# Altium schematic sheet 6 Power.SchDoc
size 420 x 297 mm; SheetNumber: 7; SheetTotal: 9
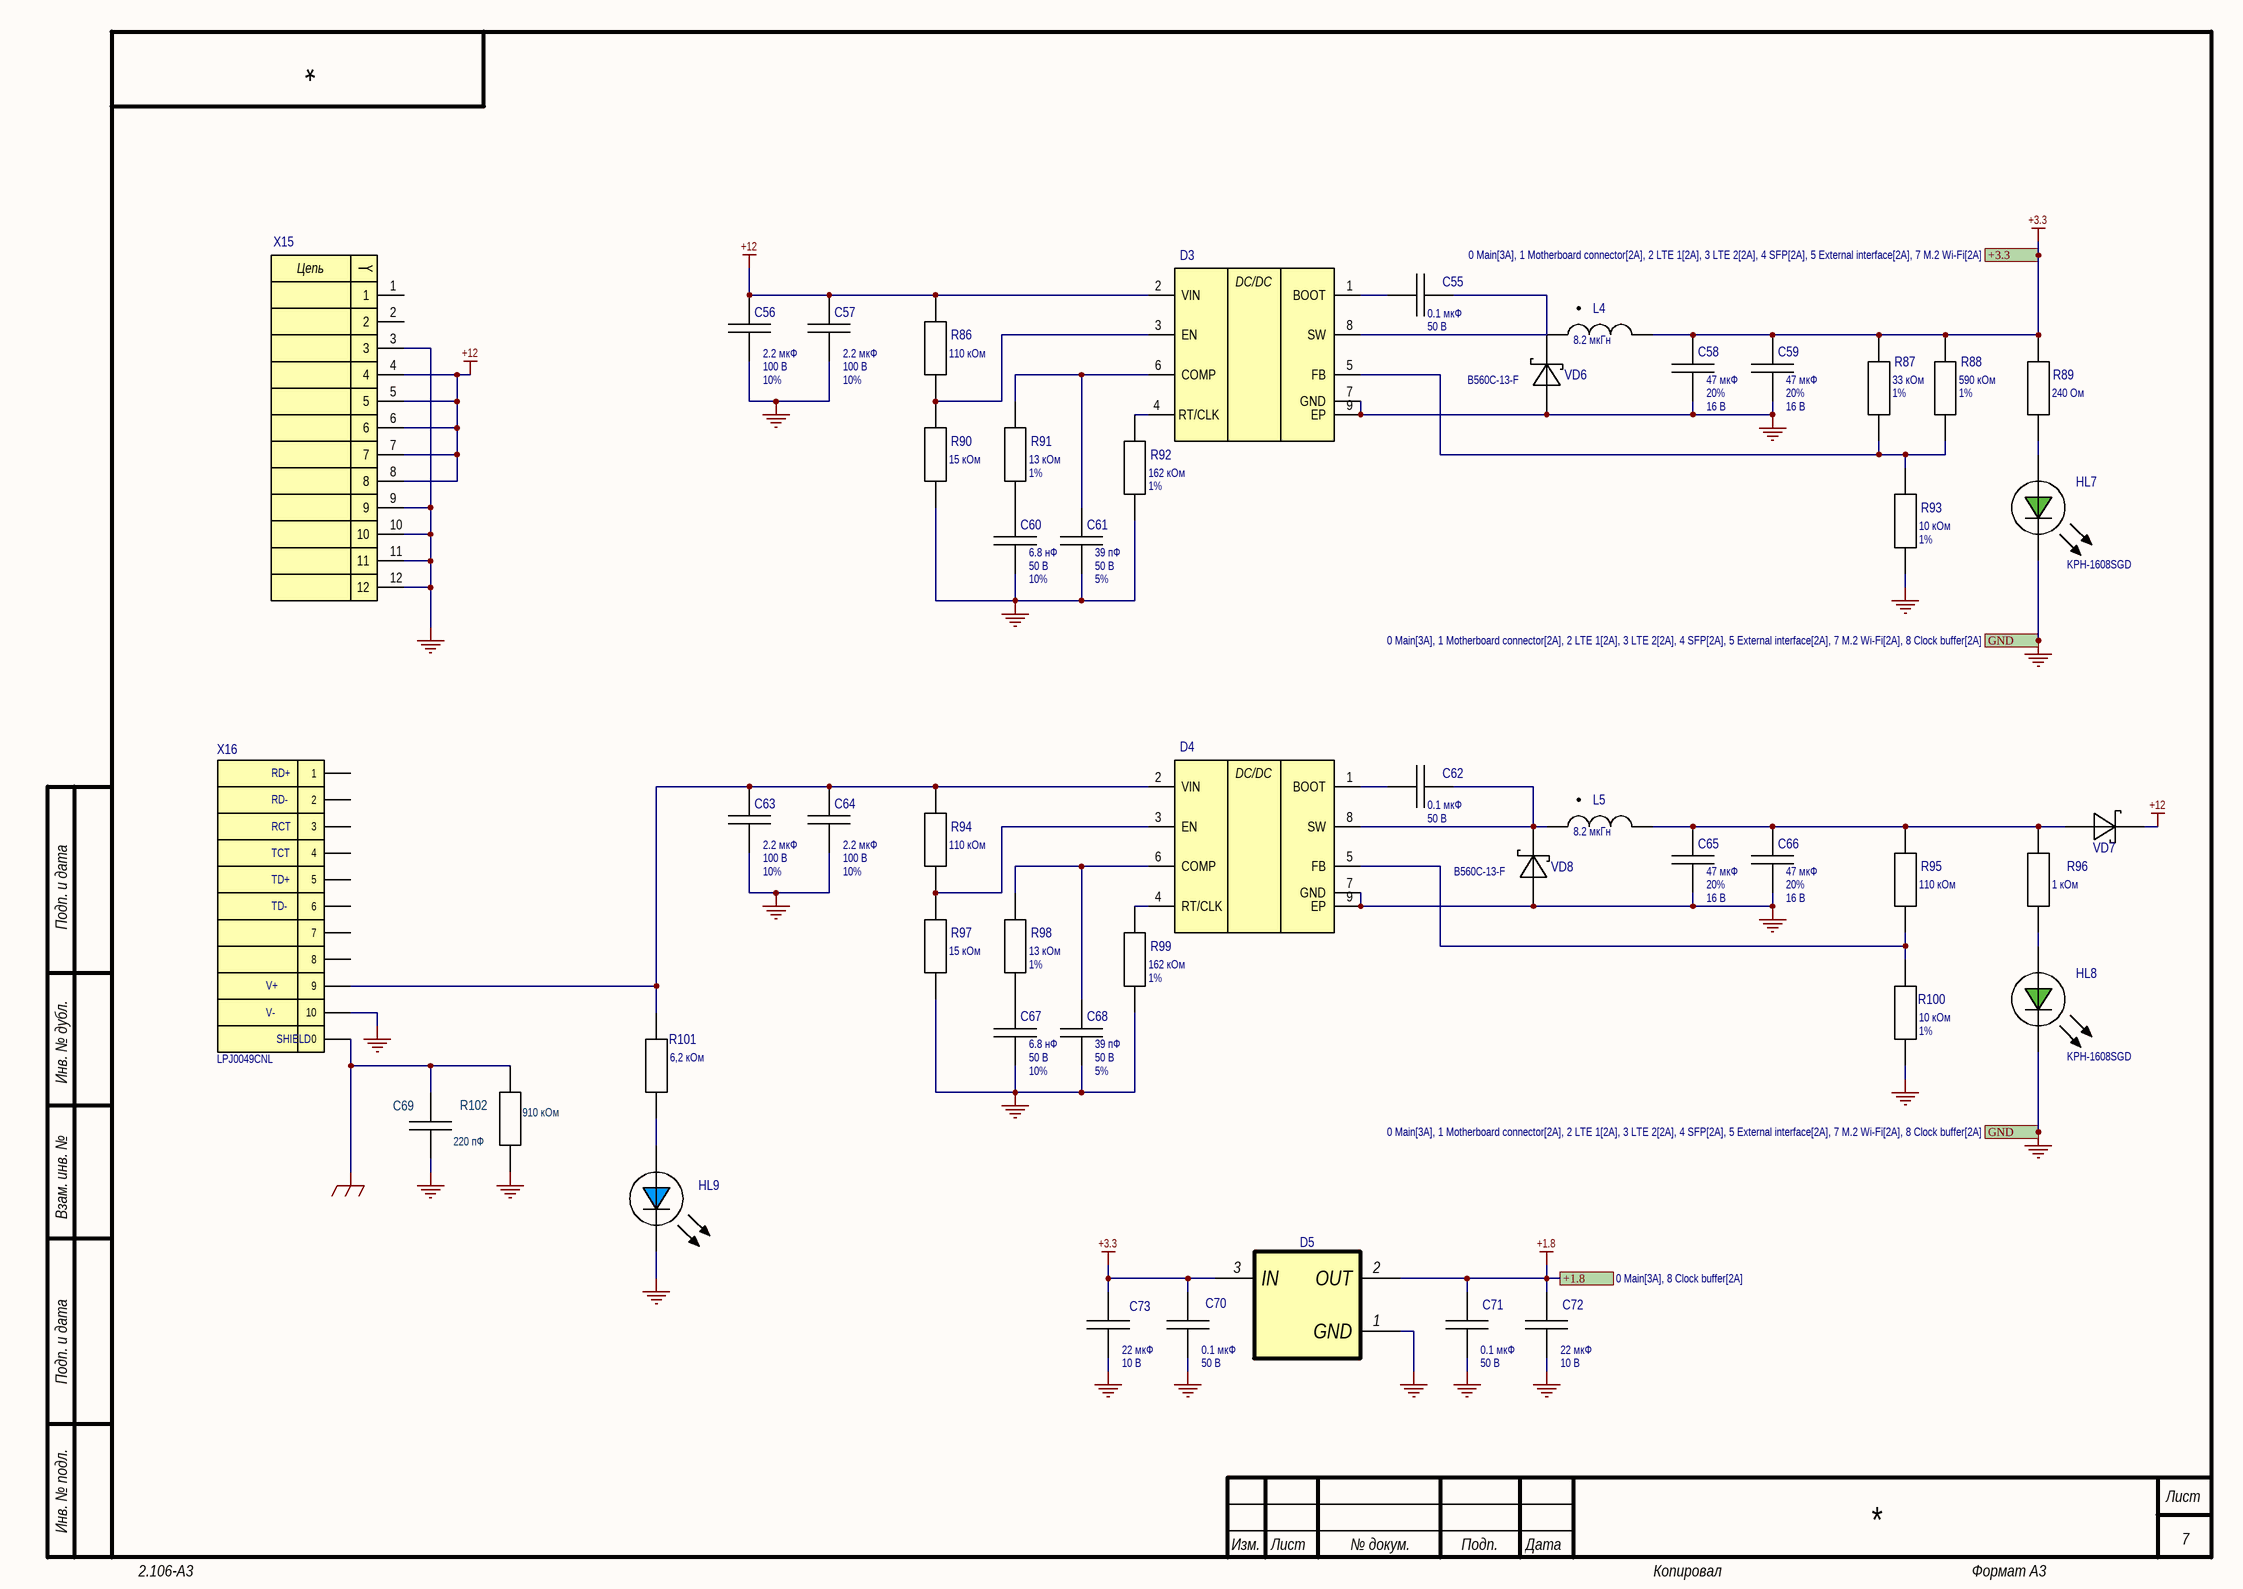
[diagram p0: 6 Power.SchDoc]

## Parts
C55  value 0.1 мкФ  Напряжение: 50 В  [CAP_0402]
C56  value 2.2 мкФ  Tolerance: 10%  Напряжение: 100 В  [CAP_1206]
C57  value 2.2 мкФ  Tolerance: 10%  Напряжение: 100 В  [CAP_1206]
C58  value 47 мкФ  Tolerance: 20%  Напряжение: 16 В  [CAP_1210]
C59  value 47 мкФ  Tolerance: 20%  Напряжение: 16 В  [CAP_1210]
C60  value 6.8 нФ  Tolerance: 10%  Напряжение: 50 В  [CAP_0402]
C61  value 39 пФ  Tolerance: 5%  Напряжение: 50 В  [CAP_0402]
C62  value 0.1 мкФ  Напряжение: 50 В  [CAP_0402]
C63  value 2.2 мкФ  Tolerance: 10%  Напряжение: 100 В  [CAP_1206]
C64  value 2.2 мкФ  Tolerance: 10%  Напряжение: 100 В  [CAP_1206]
C65  value 47 мкФ  Tolerance: 20%  Напряжение: 16 В  [CAP_1210]
C66  value 47 мкФ  Tolerance: 20%  Напряжение: 16 В  [CAP_1210]
C67  value 6.8 нФ  Tolerance: 10%  Напряжение: 50 В  [CAP_0402]
C68  value 39 пФ  Tolerance: 5%  Напряжение: 50 В  [CAP_0402]
C69  value 220 пФ  [CAP_1812]
C70  value 0.1 мкФ  Напряжение: 50 В  [CAP_0402]
C71  value 0.1 мкФ  Напряжение: 50 В  [CAP_0402]
C72  value 22 мкФ  Напряжение: 10 В  [CAP_0603]
C73  value 22 мкФ  Напряжение: 10 В  [CAP_0603]
D3  TPS54360DDA  [HSOIC-8_EP]  (value not drawn)
D4  TPS54360DDA  [HSOIC-8_EP]  (value not drawn)
D5  GM1117-1.8ST3R  [SOT-223]  (value not drawn)
HL7  KPH-1608SGD  [LED_0603_GREEN]
HL8  KPH-1608SGD  [LED_0603_GREEN]
HL9  XL-1608UBC-04  [LED_0603_BLUE]  (value not drawn)
L4  value 8.2 мкГн  [MWSA0603S]  (hidden comment: STD_IND)
L5  value 8.2 мкГн  [MWSA0603S]  (hidden comment: STD_IND)
R86  value 110 кОм  [RES_0603]  (hidden comment: STD_RES)
R87  value 33 кОм  Tolerance: 1%  [RES_0402]  (hidden comment: STD_RES)
R88  value 590 кОм  Tolerance: 1%  [RES_0603]  (hidden comment: STD_RES)
R89  value 240 Ом  [RES_0402]  (hidden comment: STD_RES)
R90  value 15 кОм  [RES_0402]  (hidden comment: STD_RES)
R91  value 13 кОм  Tolerance: 1%  [RES_0402]  (hidden comment: STD_RES)
R92  value 162 кОм  Tolerance: 1%  [RES_0603]  (hidden comment: STD_RES)
R93  value 10 кОм  Tolerance: 1%  [RES_0402]  (hidden comment: STD_RES)
R94  value 110 кОм  [RES_0603]  (hidden comment: STD_RES)
R95  value 110 кОм  [RES_0603]  (hidden comment: STD_RES)
R96  value 1 кОм  [RES_0402]  (hidden comment: STD_RES)
R97  value 15 кОм  [RES_0402]  (hidden comment: STD_RES)
R98  value 13 кОм  Tolerance: 1%  [RES_0402]  (hidden comment: STD_RES)
R99  value 162 кОм  Tolerance: 1%  [RES_0603]  (hidden comment: STD_RES)
R100  value 10 кОм  Tolerance: 1%  [RES_0402]  (hidden comment: STD_RES)
R101  value 6,2 кОм  [RES_0805]  (hidden comment: STD_RES)
R102  value 910 кОм  [RES_1206]  (hidden comment: STD_RES)
VD6  PartNumber: B560C-13-F  [SMC]  (hidden comment: STD_DIODE_SCHOTTKY)
VD7  STD_DIODE_SCHOTTKY  [TO277A]  (value not drawn)
VD8  PartNumber: B560C-13-F  [SMC]  (hidden comment: STD_DIODE_SCHOTTKY)
X15  STD_CON12  [61301221121]  (value not drawn)
X16  LPJ0049CNL  [LPJ0049CNL]

## Ports
+1.8 (see 0 Main[3A], 8 Clock buffer[2A]), +3.3 (see 0 Main[3A], 1 Motherboard connector[2A], 2 LTE 1[2A], 3 LTE 2[2A], 4 SFP[2A], 5 External interface[2A], 7 M.2 Wi-Fi[2A]), GND (see 0 Main[3A], 1 Motherboard connector[2A], 2 LTE 1[2A], 3 LTE 2[2A], 4 SFP[2A], 5 External interface[2A], 7 M.2 Wi-Fi[2A], 8 Clock buffer[2A])

## Nets
+1.8: C71.1 C72.1 D5.2(OUT) ; port +1.8
+3.3: C58.1 C59.1 C70.1 C73.1 D5.3(IN) L4.2 R87.2 R88.2 R89.2 ; port +3.3
+12: C56.1 C57.1 D3.2(VIN) R86.2 VD7.1 X15.4 X15.5 X15.6 X15.7 X15.8
GND: C56.2 C57.2 C58.2 C59.2 C60.2 C61.2 C63.2 C64.2 C65.2 C66.2 C67.2 C68.2 C69.1 C70.2 C71.2 C72.2 C73.2 D3.7(GND) D3.9(EP) D4.7(GND) D4.9(EP) D5.1(GND) HL7.2(K) HL8.2(K) HL9.2(K) R90.1 R92.1 R93.1 R97.1 R99.1 R100.1 R102.1 VD6.2 VD8.2 X15.3 X15.9 X15.10 X15.11 X15.12 X16.10 ; port GND
GNDG: C69.2 R102.2 X16.0
NetC55_1: C55.1 D3.1(BOOT)
NetC55_2: C55.2 D3.8(SW) L4.1 VD6.1
NetC60_1: C60.1 R91.1
NetC61_1: C61.1 D3.6(COMP) R91.2
NetC62_1: C62.1 D4.1(BOOT)
NetC62_2: C62.2 D4.8(SW) L5.1 VD8.1
NetC63_1: C63.1 C64.1 D4.2(VIN) R94.2 R101.2 X16.9
NetC65_1: C65.1 C66.1 L5.2 R95.2 R96.2 VD7.2
NetC67_1: C67.1 R98.1
NetC68_1: C68.1 D4.6(COMP) R98.2
NetD3_3: D3.3(EN) R86.1 R90.2
NetD3_4: D3.4(RT/CLK) R92.2
NetD3_5: D3.5(FB) R87.1 R88.1 R93.2
NetD4_3: D4.3(EN) R94.1 R97.2
NetD4_4: D4.4(RT/CLK) R99.2
NetD4_5: D4.5(FB) R95.1 R100.2
NetHL7_1: HL7.1(A) R89.1
NetHL8_1: HL8.1(A) R96.1
NetHL9_1: HL9.1(A) R101.1

Not connected (* = marked no-connect by the designer): X15 1 2; X16 1 2 3 4 5 6 7 8

## Notes on the sheet
- Подп. и дата
- Инв. № дубл.
- Взам. инв. №
- Инв. № подл.
- Изм.
- Лист
- № докум.
- Подп.
- Дата
- 2.106-A3
- Копировал
- Формат А3
- (in symbol 61301221121) Цепь
- (in symbol LPJ0049CNL) RD+; RD-; RCT; TCT; TD+; TD-; V+; V-; SHIELD
- (in symbol TPS54360DDA) DC/DC

## Library data of the parts
C55 C62 C70 C71 = CC0402KRX7R9BB104: Конденсатор CHIP-0402 0.1 мкФ 50 В 10% X7R; Manufacturer: YAGEO; ID: 357; Температура: -55...+85°C; Autor: Admin; PartNumber: CC0402KRX7R9BB104; Type: CHIP-0402; Tolerance: 10%; Диэлектрик: X7R; Data: 10-04-2024
C56 C57 C63 C64 = GRM31CR72A225KA73L: Конденсатор CHIP-1206 2.2 мкФ 100 В 10% X7R; Manufacturer: MURATA; ID: 355; Температура: -55...+125°C; Autor: Admin; PartNumber: GRM31CR72A225KA73L; Type: CHIP-1206; Диэлектрик: X7R; Data: 10-01-2024
C58 C59 C65 C66 = GRM32ER61C476ME15L: Конденсатор CHIP-1210 47 мкФ 16 В 20% X5R; Manufacturer: MURATA; ID: 128; Температура: -55...+85°C; Autor: Цислав А.Н.; PartNumber: GRM32ER61C476ME15L; Type: CHIP-1210; Диэлектрик: X5R; Data: 09-05-2013
C60 C67 = CC0402KRX7R8BB682: Конденсатор CHIP-0402 6.8 нФ 50 В 10% X7R; Manufacturer: YAGEO; ID: 375; Температура: -55...+85°C; Autor: Admin; PartNumber: CC0402KRX7R8BB682; Type: CHIP-0402; Диэлектрик: X7R; Data: 11-12-2024
C61 C68 = CC0402JRNPO9BN390: Конденсатор CHIP-0402 39 пФ 50 В 5% NPO; Manufacturer: YAGEO; ID: 220; Температура: -55...+85°C; Autor: Admin; PartNumber: CC0402JRNPO9BN390; Type: CHIP-0402; Диэлектрик: NPO; Data: 08-21-2017
C69 = CC1812JKNPOEBN221: Конденсатор CHIP-1812 220 пФ 3000 В 5% NPO; Manufacturer: YAGEO; ID: 339; Напряжение: 3000 В; Температура: -55...+125°C; Autor: Admin; PartNumber: CC1812JKNPOEBN221; Type: CHIP-1812; Tolerance: 5%; Диэлектрик: NPO; Data: 11-08-2023
C72 C73 = GRM188R61A226ME15: Конденсатор CHIP-0603 22 мкФ 10 В 20% X5R; Manufacturer: MURATA; ID: 233; Температура: -55...+85°C; Autor: Admin; PartNumber: GRM188R61A226ME15; Type: CHIP-0603; Tolerance: 20%; Диэлектрик: X5R; Data: 01-05-2018
D3 D4 = TPS54360DDA: Микросхема Texas Instruments   4.5 V to 60 V Input, 3.5 A, Step Down DC-DC Converter with Eco-mode; ID: 770; Type: DC/DC Step-Down; Voltage: 60В; Current: 3.5 A; Температура: -40...+85°C; Autor: Admin; PartNumber: TPS54360DDA; Value: 4.5 V to 60 V Input, 3.5 A, Step Down DC-DC Converter with Eco-mode; Manufacturer: Texas Instruments; Data: 09-29-2024
D5 = GM1117-1.8ST3R: Микросхема Gamma Electronica  1,0 A Low-Dropout LDO; ID: 826; Type: LDOs; Voltage: 1,8 В; Current: 1 А; Температура: -40...+85°C; Autor: Admin; PartNumber: GM1117-1.8ST3R; Value: 1,0 A Low-Dropout LDO; Manufacturer: Gamma Electronica; Data: 12-16-2024
HL7 HL8 = KPH-1608SGD: Диод Kingbright 2 В 20 мА GREEN; ID: 14; Type: LED; U_direct: 2 В; Температура: -40...+85°C; Autor: Admin; PartNumber: KPH-1608SGD; Current: 20 мА GREEN; Manufacturer: Kingbright; Data: 08-27-2018
HL9 = XL-1608UBC-04: Диод XINGLIGHT 3,3 В 20 мА; ID: 133; Type: LED; U_direct: 3,3 В; U_reverse: 5 В; Current: 20 мА; Температура: -20...+85°C; Autor: Admin; PartNumber: XL-1608UBC-04; Manufacturer: XINGLIGHT; Data: 05-24-2024
L4 L5 = WSA0603S-8R2MT: Катушка индуктивности MWSA0603S 8.2 мкГн 20%; Manufacturer: SUNLORD; ID: 233; Current: 5 А; Температура: -40...+125°C; Autor: Admin; PartNumber: WSA0603S-8R2MT; Type: MWSA0603S; Tolerance: 20%; Data: 10-01-2024
R86 R94 R95 = RC0603FR-07110K: Резистор CHIP-0603 110 кОм 1%; Manufacturer: YAGEO; ID: 219; ТКС: 100 ppm/K; Температура: -55...+85°C; Autor: Цислав А.Н.; PartNumber: RC0603FR-07110K; Type: CHIP-0603; Tolerance: 1%; Data: 09-05-2013
R87 = RC0402FR-0733KL: Резистор CHIP-0402 33 кОм 1%; Manufacturer: YAGEO; ID: 435; ТКС: 100 ppm/K; Температура: -55...+155°C; Autor: Цислав А.Н.; PartNumber: RC0402FR-0733KL; Type: CHIP-0402; Data: 02-03-2014
R88 = RC0603FR-07590K: Резистор CHIP-0603 590 кОм 1%; Manufacturer: YAGEO; ID: 647; ТКС: 100 ppm/K; Температура: -55...+155°C; Autor: Admin; PartNumber: RC0603FR-07590K; Type: CHIP-0603; Data: 11-15-2018
R89 = RC0402FR-07240RL: Резистор CHIP-0402 240 Ом 1%; Manufacturer: YAGEO; ID: 313; ТКС: 100 ppm/K; Температура: -55...+155°C; Autor: Цислав А.Н.; PartNumber: RC0402FR-07240RL; Type: CHIP-0402; Tolerance: 1%; Data: 02-03-2014
R90 R97 = RC0402FR-0715KL: Резистор CHIP-0402 15 кОм 1%; Manufacturer: YAGEO; ID: 420; ТКС: 100 ppm/K; Температура: -55...+155°C; Autor: Цислав А.Н.; PartNumber: RC0402FR-0715KL; Type: CHIP-0402; Tolerance: 1%; Data: 02-03-2014
R91 R98 = RC0402FR-0713KL: Резистор CHIP-0402 13 кОм 1%; Manufacturer: YAGEO; ID: 419; ТКС: 100 ppm/K; Температура: -55...+155°C; Autor: Цислав А.Н.; PartNumber: RC0402FR-0713KL; Type: CHIP-0402; Data: 02-03-2014
R92 R99 = RC0603FR-07162K: Резистор CHIP-0603 162 кОм 1%; Manufacturer: YAGEO; ID: 224; ТКС: 100 ppm/K; Температура: -55...+85°C; Autor: Цислав А.Н.; PartNumber: RC0603FR-07162K; Type: CHIP-0603; Data: 09-05-2013
R93 R100 = RC0402FR-0710KL: Резистор CHIP-0402 10 кОм 1%; Manufacturer: YAGEO; ID: 412; ТКС: 100 ppm/K; Температура: -55...+155°C; Autor: Цислав А.Н.; PartNumber: RC0402FR-0710KL; Type: CHIP-0402; Data: 02-03-2014
R96 = RC0402JR-071KL: Резистор CHIP-0402 1 кОм 5%; Manufacturer: YAGEO; ID: 338; ТКС: 100 ppm/K; Температура: -55...+155°C; Autor: Цислав А.Н.; PartNumber: RC0402JR-071KL; Type: CHIP-0402; Tolerance: 5%; Data: 02-03-2014
R101 = RC0805JR-076K2L: Резистор CHIP-0805 6,2 кОм 5%; Manufacturer: YAGEO; ID: 505; ТКС: 100 ppm/K; Температура: -55...+155°C; Autor: Admin; PartNumber: RC0805JR-076K2L; Type: CHIP-0805; Tolerance: 5%; Data: 01-29-2016
R102 = RC1206FR-07910KL: Резистор CHIP-1206 910 кОм 1%; Manufacturer: YAGEO; ID: 731; ТКС: 100 ppm/K; Температура: -55...+155°C; Autor: Admin; PartNumber: RC1206FR-07910KL; Type: CHIP-1206; Tolerance: 1%; Data: 11-08-2023
VD6 VD8 = B560C-13-F: Диод Diodes 700 мВ 5 А; ID: 55; Type: Diode Schottky; U_direct: 700 мВ; U_reverse: 60 В; Current: 5 А; Температура: -40...+85°C; Autor: Admin; Manufacturer: Diodes; Data: 06-29-2016
VD7 = V10P20-M3: Диод Vishay 590 мВ 10 А; ID: 12; Type: Diode Schottky; U_direct: 590 мВ; U_reverse: 200 В; Current: 10 А; Температура: -40...+85°C; Autor: Цислав А.Н.; PartNumber: V10P20-M3; Manufacturer: Vishay; Data: 04-01-2014
X15 = 61301221121: Разъем Wurth PLD; ID: 282; Contact: 12; Pitch: 2,54 мм; Current: 3 А; Autor: Admin; PartNumber: 61301221121; Type: PLD; Mounting: Сквозной; Manufacturer: Wurth; Data: 08-05-2019
X16 = LPJ0049CNL: Разъем LINK-PP RJ-45; ID: 494; Contact: 10; Pitch: 2.54 мм; Current: 0.35А; Autor: Admin; PartNumber: LPJ0049CNL; Type: RJ-45; Mounting: Сквозной; Manufacturer: LINK-PP; Data: 11-13-2025